# EAGLE design ms5839_without_trub (EAGLE 9.6.2)
COMPONENTS: MS5839; DESCRIPTION: Sensormodul; DRAWING_VERSION: 1.0; DRAWN: Tobias Poppe; FIRMA: Tobias Poppe; PRINTDATE: 30.01.2023; PROJECT: Open-WaLeS; STATUS: Prod.
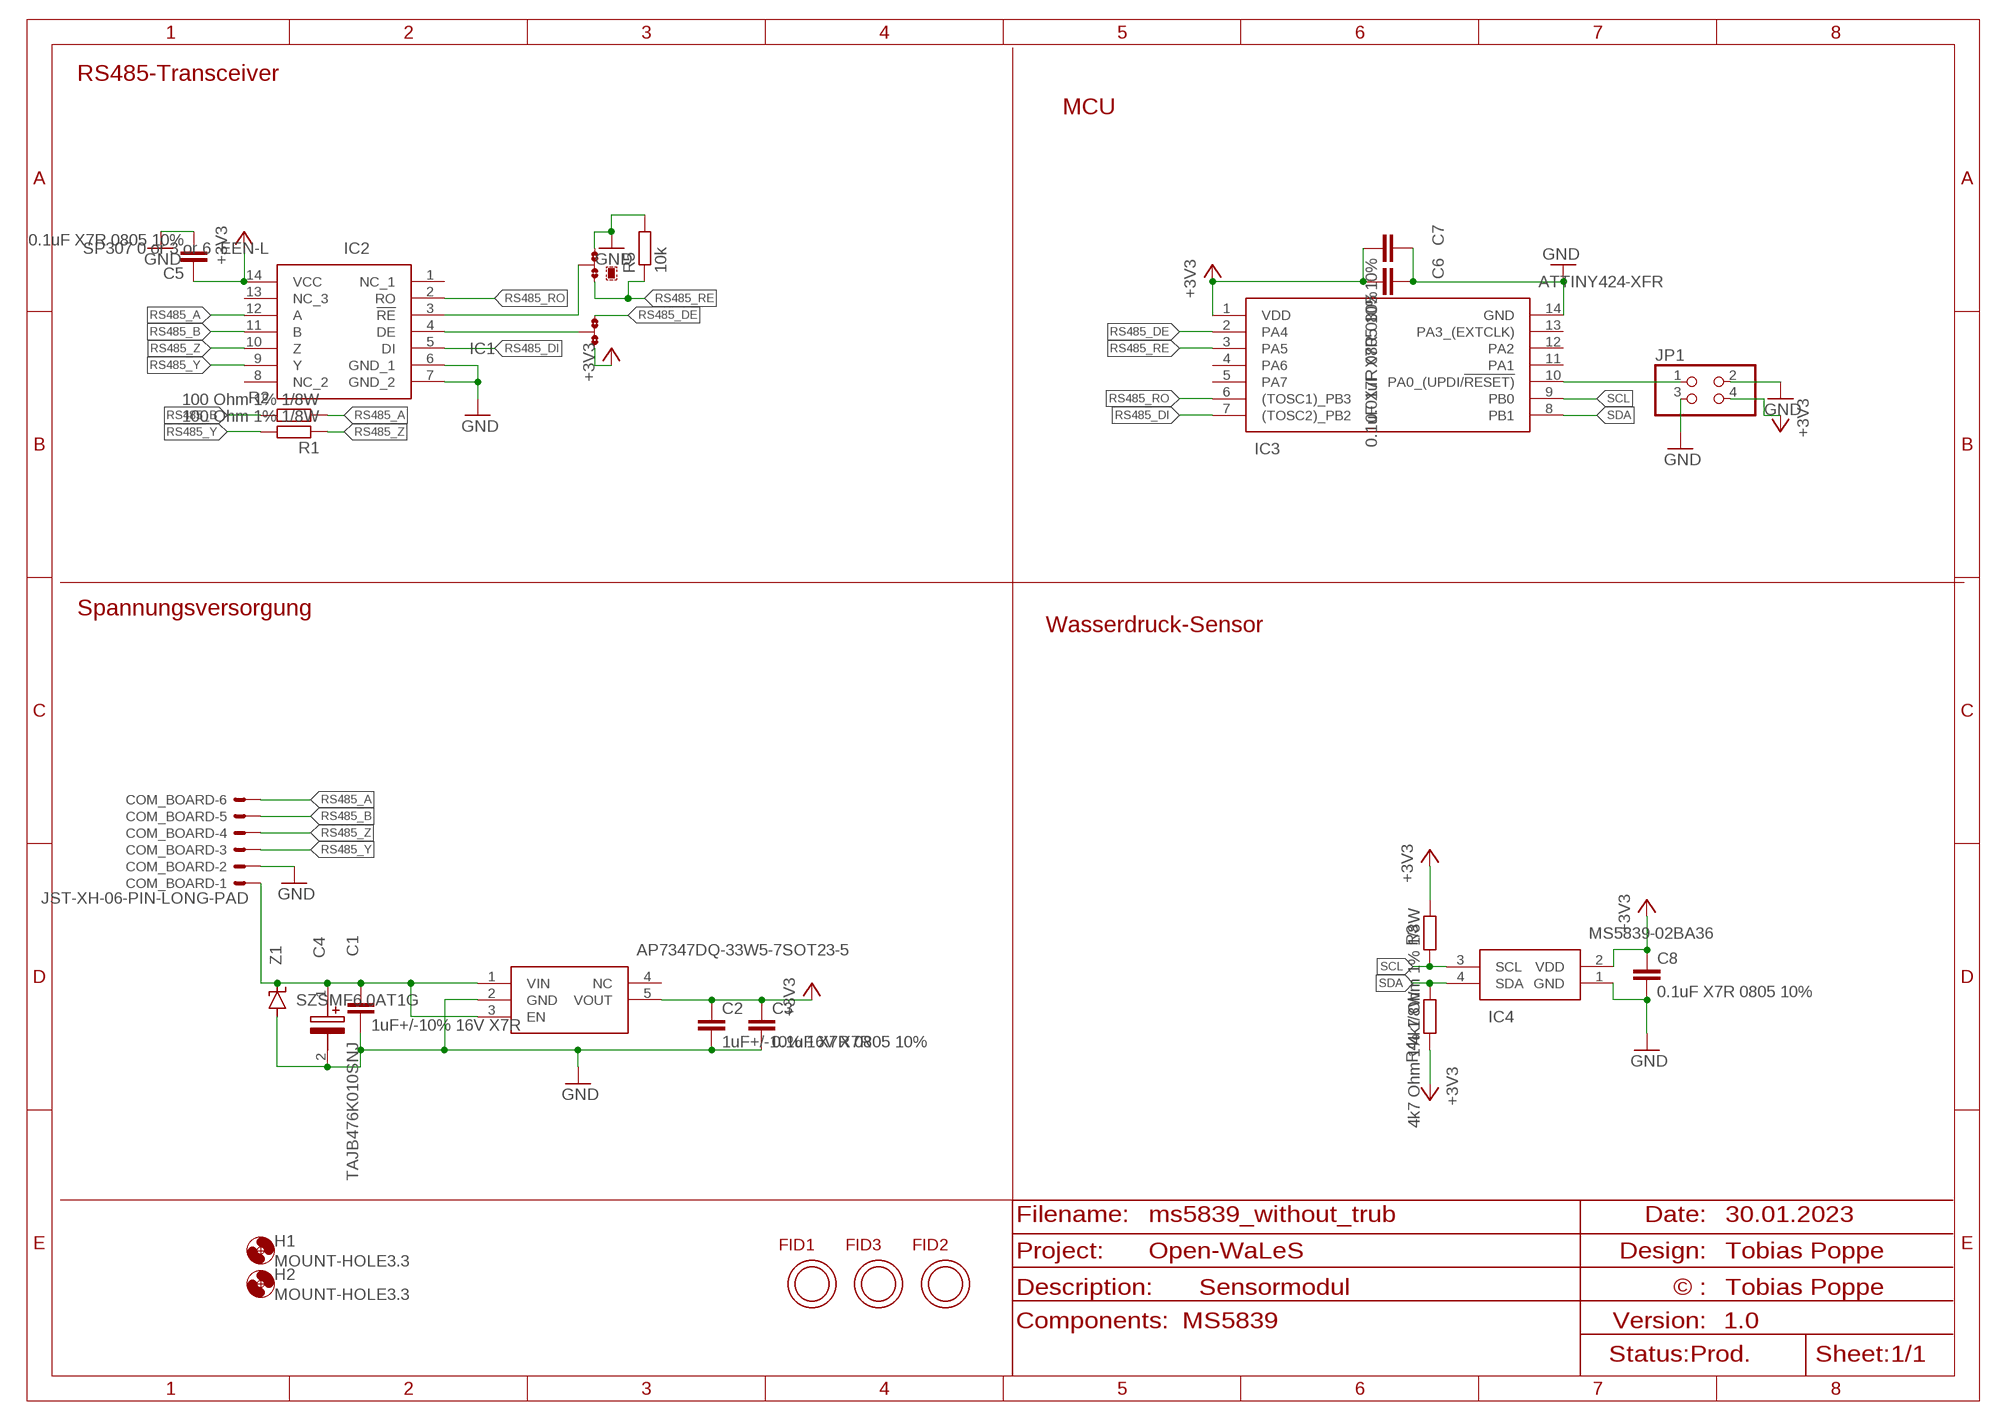
[diagram p0: schematic, sheet 1]

## Parts
C1  1uF+/-10% 16V X7R  C-EUC0805  [C0805]
C2  1uF+/-10% 16V X7R  C-EUC0805  [C0805]
C3  0.1uF X7R 0805 10%  C-EUC0805  [C0805]
C4  TAJB476K010SNJ  [CAPPM3528X210N]
C5  0.1uF X7R 0805 10%  C-EUC0805  [C0805]
C6  0.1uF X7R 0805 10%  C-EUC0805  [C0805]
C7  0.01uF X7R 0805 10%  C-EUC0805  [C0805]
C8  0.1uF X7R 0805 10%  C-EUC0805  [C0805]
COM_BOARD  JST-XH-06-PIN-LONG-PAD  [JST-XH-06-PACKAGE-LONG-PAD]
FID1  OPEN-PNP-FIDUCIAL  [OPEN-PNP-FIDUCIAL]
FID2  OPEN-PNP-FIDUCIAL  [OPEN-PNP-FIDUCIAL]
FID3  OPEN-PNP-FIDUCIAL  [OPEN-PNP-FIDUCIAL]
H1  MOUNT-HOLE3.3  [3,3]
H2  MOUNT-HOLE3.3  [3,3]
IC1  AP7347DQ-33W5-7SOT23-5  [SOT95P240X110-5N]
IC2  SP307 0 or 3 or 6 EEN-L  SP3076EEN-L  [SOIC127P600X175-14N]
IC3  ATTINY424-XFR  [SOP65P640X120-14N]
IC4  MS5839-02BA36  [MS583902BA36]
JMP1  0R-JUMPA  [A0R-JMP]
JMP2  0R-JUMPA  [A0R-JMP]
JP1  PINHD-2X2  [2X02]
R1  100 Ohm 1% 1/8W  R-EU_R0805  [R0805]
R2  100 Ohm 1% 1/8W  R-EU_R0805  [R0805]
R3  4k7 Ohm 1% 1/8W  R-EU_R0805  [R0805]
R4  4k7 Ohm 1% 1/8W  R-EU_R0805  [R0805]
R5  10k  R-EU_M0805  [M0805]
Z1  SZSMF6.0AT1G  SZSMF_XX  [SOD123]

## Nets
!RE: IC2.3(!RE) JMP2.2
+3V3: C2.1 C3.1 C5.1 C6.2 C7.2 C8.1 IC1.5(VOUT) IC2.14(VCC) IC3.1(VDD) IC4.2(VDD) JMP1.1 JP1.4 R3.1 R4.2
DE: IC2.4(DE) JMP1.2
GND: C1.2 C2.2 C3.2 C4.2(-) C5.2 C6.1 C7.1 C8.2 COM_BOARD.2 IC1.2(GND) IC2.6(GND_1) IC2.7(GND_2) IC3.14(GND) IC4.1(GND) JMP2.3 JP1.2 JP1.3 R5.2 Z1.A
N$1: C1.1 C4.1(+) COM_BOARD.1 IC1.1(VIN) IC1.3(EN) Z1.C
N$2: IC3.10(PA0_(UPDI/!RESET)) JP1.1
RS485_A: COM_BOARD.6 IC2.12(A) R2.1
RS485_B: COM_BOARD.5 IC2.11(B) R2.2
RS485_DE: IC3.2(PA4) JMP1.3
RS485_DI: IC2.5(DI) IC3.7((TOSC2)_PB2)
RS485_RE: IC3.3(PA5) JMP2.1 R5.1
RS485_RO: IC2.2(RO) IC3.6((TOSC1)_PB3)
RS485_Y: COM_BOARD.3 IC2.9(Y) R1.2
RS485_Z: COM_BOARD.4 IC2.10(Z) R1.1
SCL: IC3.9(PB0) IC4.3(SCL) R3.2
SDA: IC3.8(PB1) IC4.4(SDA) R4.1
Unconnected: IC1.4(NC) IC2.1(NC_1) IC2.8(NC_2) IC2.13(NC_3) IC3.4(PA6) IC3.5(PA7) IC3.11(PA1) IC3.12(PA2) IC3.13(PA3_(EXTCLK))

## Notes on the sheet
- RS485-Transceiver
- MCU
- Spannungsversorgung
- Wasserdruck-Sensor

## Library data of the parts
C1-C3 C5-C8 = rcl:C-EU: CAPACITOR, European symbol; SPICEPREFIX: C
C4 = samacsys:TAJB476K010SNJ: Tantalum Capacitors - Solid SMD 10volts 47uF 10% Source: Datasheet <http://datasheets.avx.com/TAJ.pdf>; ARROW_PART_NUMBER: TAJB476K010SNJ; ARROW_PRICE-STOCK: https://www.arrow.com/en/products/tajb476k010snj/avx; DESCRIPTION: Tantalum Capacitors - Solid SMD 10volts 47uF 10%; HEIGHT: 2.1mm; MANUFACTURER_NAME: AVX; MANUFACTURER_PART_NUMBER: TAJB476K010SNJ; MOUSER_PART_NUMBER: 581-TAJB476K010SNJ; MOUSER_PRICE-STOCK: https://www.mouser.co.uk/ProductDetail/AVX/TAJB476K010SNJ?qs=ZkOCJBwOl244F5j46leeNA%3D%3D
COM_BOARD = Rembrandt Electronics - JST XH Connectors v1-0:JST-XH-06-PIN: JST XH Connector 2 Pin Wire to board connector. Pitch: 2,54 mm, (0.100") Number of pins: 6 Created by Rembrandt Electronics www.rembrandtelectronics.com
FID1-FID3 = topo-eng:OPEN-PNP-FIDUCIAL
H1 H2 = holes:MOUNT-HOLE: MOUNTING HOLE with drill center marker
IC1 = samacsys:AP7347DQ-33W5-7: LDO Voltage Regulators LDO CMOS LowCurr SOT25 T&R 3K Source: Datasheet <https://ad.componentsearchengine.com/partRequest.html?fs=0&partNumber=AP7347DQ-33W5-7&partID=15420390&lang=null&packageCategoryID=54&C=1&W=1>
IC2 = samacsys:SP3076EEN-L: RS-422/RS-485 Interface IC RS485/RS422 Driver/ Receiver Transceiver Source: Datasheet <https://www.exar.com/content/document.ashx?id=1399>; DESCRIPTION: RS-422/RS-485 Interface IC RS485/RS422 Driver/ Receiver Transceiver; HEIGHT: 1.75mm; MANUFACTURER_NAME: MaxLinear, Inc.; MANUFACTURER_PART_NUMBER: SP3076EEN-L; MOUSER_PART_NUMBER: 701-SP3076EEN-L; MOUSER_PRICE-STOCK: https://www.mouser.co.uk/ProductDetail/MaxLinear/SP3076EEN-L?qs=H%252BP%2FcHWii3dfBcWqKh1L5g%3D%3D
IC3 = samacsys:ATTINY424-XFR: 8-bit Microcontrollers - MCU 20MHz, 4KB, TSSOP14, Ind 125C, Green, T&R Source: Datasheet <https://eu.mouser.com/datasheet/2/268/ATtiny1624_26_27_DataSheet_DS40002234A-1984012.pdf>; DESCRIPTION: 8-bit Microcontrollers - MCU 20MHz, 4KB, TSSOP14, Ind 125C, Green, T&R; HEIGHT: 1.2mm; MANUFACTURER_NAME: Microchip; MANUFACTURER_PART_NUMBER: ATTINY424-XFR; MOUSER_PART_NUMBER: 579-ATTINY424-XFR; MOUSER_PRICE-STOCK: https://www.mouser.co.uk/ProductDetail/Microchip-Technology/ATTINY424-XFR?qs=pUKx8fyJudDOEG3jn4DZaw%3D%3D
IC4 = samacsys:MS5839-02BA36: Board Mount Pressure Sensors MS5839-02BA36 CL RESISTANT LS T&R SEN Source: Datasheet <https://www.te.com/commerce/DocumentDelivery/DDEController?Action=srchrtrv&DocNm=MS5839-02BA&DocType=DS&DocLang=English>; DESCRIPTION: Board Mount Pressure Sensors MS5839-02BA36 CL RESISTANT LS T&R SEN; HEIGHT: 2.65mm; MANUFACTURER_NAME: TE Connectivity; MANUFACTURER_PART_NUMBER: MS5839-02BA36; MOUSER_PART_NUMBER: 824-MS5839-02BA36; MOUSER_PRICE-STOCK: https://www.mouser.co.uk/ProductDetail/Measurement-Specialties/MS5839-02BA36?qs=xZ%2FP%252Ba9zWqZ%2FNhMNRu8tng%3D%3D
JMP1 JMP2 = jump-0r-smd:0R-JUMP: SMD 0R 0805 Jumper
JP1 = pinhead:PINHD-2X2: PIN HEADER
R1-R5 = rcl:R-EU_: RESISTOR, European symbol; SPICEPREFIX: R
Z1 = topo-eng:SZSMF_XX

## Board
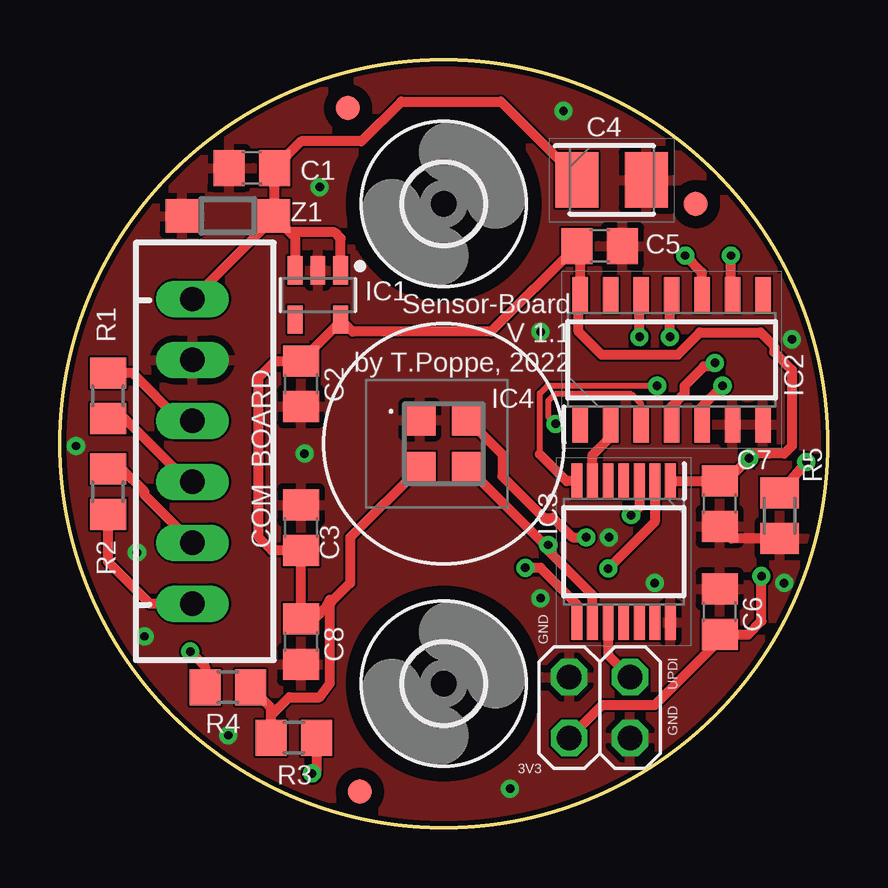
[diagram p1: board, top side]
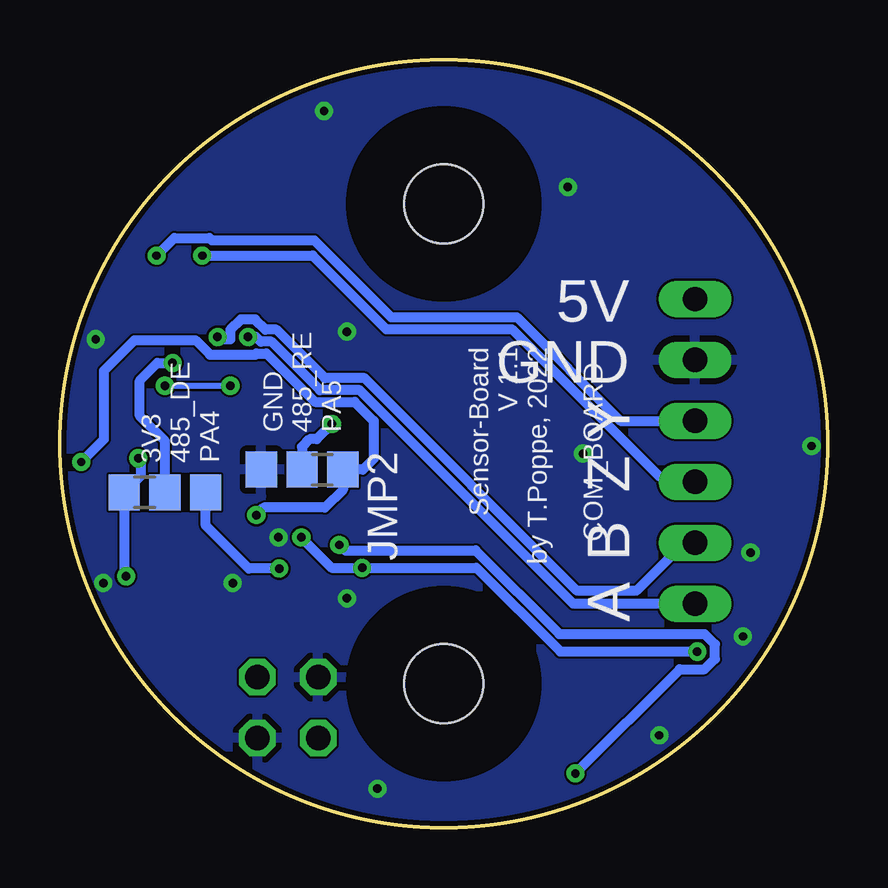
[diagram p2: board, bottom side, seen from below]

Size 32 x 32 mm. Coordinates in mm from the lower left corner, seen from the top.
Outline: circle at 16,16 radius 16
Copper layers (1*16): Top 0.035mm / dielectric 1.065mm / Bottom 0.035mm
Design rules "jlcpcb_4_layer *": minimum track width 3.5mil, minimum drill 0.2mm, track to track 3.5mil, track to pad 6mil, pad to pad 6mil, via to via 6mil, smd to smd 6mil, copper to edge 0.2mm, drill to drill 6mil, minimum pad ring 10mil, minimum via ring 8mil, stop-mask expansion 4mil, vias tented up to drill 0mil, thermal gap 10mil

### Footprints (pad centres in the part's own frame; a part is rotated, then mirrored left to right if it is on the bottom)
C0805 = smd 1.3 x 1.5: 1 -0.95,0; 2 0.95,0
CAPPM3528X210N = smd 1.8 x 2.3: 1 -1.45,0; 2 1.45,0
JST-XH-06-PACKAGE-LONG-PAD = drill 1.016 long: 1 -6.35,0; 2 -3.81,0; 3 -1.27,0; 4 1.27,0; 5 3.81,0; 6 6.35,0
OPEN-PNP-FIDUCIAL = smd 1 x 1: FID$1 0,0
3,3 = hole 3.3: 0,0
SOT95P240X110-5N = smd 1.18 x 0.609: 1 -1.024,0.95; 2 -1.024,0; 3 -1.024,-0.95; 4 1.024,-0.95; 5 1.024,0.95
SOIC127P600X175-14N = smd 1.5 x 0.65: 1 -2.7,3.81; 2 -2.7,2.54; 3 -2.7,1.27; 4 -2.7,0; 5 -2.7,-1.27; 6 -2.7,-2.54; 7 -2.7,-3.81; 8 2.7,-3.81; 9 2.7,-2.54; 10 2.7,-1.27; 11 2.7,0; 12 2.7,1.27; 13 2.7,2.54; 14 2.7,3.81
SOP65P640X120-14N = smd 1.475 x 0.45: 1 -2.938,1.95; 2 -2.938,1.3; 3 -2.938,0.65; 4 -2.938,0; 5 -2.938,-0.65; 6 -2.938,-1.3; 7 -2.938,-1.95; 8 2.938,-1.95; 9 2.938,-1.3; 10 2.938,-0.65; 11 2.938,0; 12 2.938,0.65; 13 2.938,1.3; 14 2.938,1.95
MS583902BA36 = smd 1.3 x 1.3: 1 1,-1; 2 1,1; 3 -1,1; 4 -1,-1
A0R-JMP = smd 1.5 x 1.3: 1 0,1.7; 2 0,0; 3 0,-1.7
2X02 = drill 1.016 octagon: 1 -1.27,-1.27; 2 -1.27,1.27; 3 1.27,-1.27; 4 1.27,1.27
R0805 = smd 1.3 x 1.5: 1 -0.95,0; 2 0.95,0
M0805 = smd 1.3 x 1.6: 1 -0.95,0; 2 0.95,0
SOD123 = smd 1.4 x 1.4: A 1.9,0; C -1.9,0

### Placement (x,y rotation side)
C1  8,27.5 180 top
C2  10.05,18.5 270 top
C3  10.05,12.5 90 top
C4  23,27 0 top
C5  22.5,24.25 0 top
C6  27.5,9 270 top
C7  27.5,13.5 90 top
C8  10.05,7.75 270 top
COM_BOARD  5.52,15.68 270 top
FID1  12.5,1.5 0 top
FID2  26.5,26 0 top
FID3  12,30 0 top
H1  16,26 0 top
H2  16,6 0 top
IC1  10.75,22.2 270 top
IC2  25.5,19.5 90 top
IC3  23.5,11.5 270 top
IC4  16,16 180 top
JMP1  27.62,13.97 90 bottom
JMP2  21.91,14.92 270 bottom
JP1  22.5,5 180 top
R1  2,18 90 top
R2  2,14 90 top
R3  9.75,3.75 0 top
R4  7,5.85 0 top
R5  30,13 270 top
Z1  7,25.5 180 top

### Tracks (layer width: path | path; a pad name or v marks a point on that pad's centre or on a via)
!RE  (via drill 0.35)
  Top 0.254: IC2.3 24.23,17.66 23.81,18.07 20.64,18.07 20.34,17.78 20.34,17.14 v20.66,16.83
  Bottom 0.406: v20.66,16.83 21.3,16.19 21.59,16.19 21.91,15.88 JMP2.2
+3V3  (via drill 0.35)
  Top 0.406: IC4.2 12.1,12.1 12.1,10.19 11.3,9.4 11.1,9.19 | 11.1,9.19 11.25,9.51 11.25,6.02 10.83,5.43 9.56,5.43 8.8,4.67 R3.1 8.8,5 R4.2 | 11.1,9.19 10.61,8.7 C8.1 C3.1 8.84,11.55 8.29,12.1 8.29,18.77 8.97,19.45 C2.1 11.7,21.1 IC1.5 12.21,20.67 17.97,20.67 C5.1 21.69,24.11 IC2.14 21.62,22.13 21.62,20.67 22.57,19.72 25.75,19.72 26.67,20.64 29.21,20.64 29.78,20.07 29.78,19.82 30.51,19.08 30.51,15.91 30.2,15.59 29.56,15.59 28.93,15.59 v28.73,15.4 27.79,14.45 C7.2 27.49,14.44 IC3.1 | JP1.4 22.61,5.11 24.8,5.11 27.5,7.82 C6.2 28.69,8.05 29.24,8.61 v29.24,10.48
  Bottom 0.406: v29.24,10.48 29.32,10.56 JMP1.1 28.63,14.66 28.63,15.29 v28.73,15.4
DE  (via drill 0.35)
  Top 0.406: v27.3,19.37 27.16,19.22 26.84,19.22 26.04,18.41 26.04,18.1 25.5,17.56 IC2.4
  Bottom 0.406: v27.3,19.37 27.94,19.37 28.67,18.63 28.67,17.16 27.62,16.11 JMP1.2
GND  (via drill 0.35)
  Top 0.406: R5.2 28,12.05 C7.1
  other vias: 10.19,15.59 24.8,10.19 30.2,10.19 7.02,3.84 30.51,20.35 10.83,26.7 0.67,15.91 20.04,20.67 20.99,29.88 3.52,7.97 3.21,11.46 18.77,1.62 20.04,9.56 22.89,12.1
  pour Top: 32,0 32,32 0,32 0,0
  pour Bottom: 32,32 32,0 0,0 0,32
N$1
  Top 0.406: COM_BOARD.1 8.9,25.41 Z1.C | Z1.C 8.95,25.55 C1.1 10.06,28.61 12.57,28.61 14.23,30.27 18.38,30.27 21.55,27.09 C4.1 | Z1.C 9.58,24.82 | 9.58,24.82 9.8,24.6 IC1.3 | IC1.1 11.7,24.56 11.44,24.82 9.58,24.82
N$2
  Top 0.406: IC3.10 22.85,7.19 JP1.1
RS485_A  (via drill 0.35)
  Top 0.406: COM_BOARD.6 3.75,9.33 2,11.08 R2.1 | v24.16,20.45 24.16,22.13 IC2.12
  Bottom 0.406: COM_BOARD.6 10.6,9.33 19.51,18.24 21.16,18.24 23.18,20.26 23.63,20.26 23.82,20.45 v24.16,20.45
RS485_B  (via drill 0.35)
  Top 0.406: COM_BOARD.5 3.52,13.87 3.52,14 2.58,14.95 R2.2 | v25.43,20.45 25.43,22.13 IC2.11
  Bottom 0.406: COM_BOARD.5 5.97,11.87 7.97,9.88 10.45,9.88 19.3,18.73 20.95,18.73 22.98,20.75 23.43,20.75 23.86,21.18 24.47,21.18 24.9,20.75 24.9,20.35 25.33,20.35 v25.43,20.45
RS485_DE  (via drill 0.35)
  Top 0.406: IC3.2 24.8,12.73 v22.86,10.79
  Bottom 0.406: v22.86,10.79 24.13,10.79 25.92,12.59 JMP1.3
RS485_DI  (via drill 0.35)
  Top 0.254: 20,15.56 20,18.1 20.32,18.41 v24.9,18.41
  Top 0.406: IC3.7 21.12,14.44 20,15.56 | IC2.5 26.77,17.56 v27.62,18.41
  Bottom 0.254: v24.9,18.41 v27.62,18.41
RS485_RE  (via drill 0.35)
  Top 0.406: v31.11,15.24 R5.1 | IC3.3 24.15,13.37 v23.81,13.03
  Bottom 0.406: v23.81,13.03 23.51,13.34 20.95,13.34 20.21,14.08 JMP2.1 19.37,14.92 18.92,15.37 18.92,16.95 19.71,17.74 21.36,17.74 23.39,19.77 23.81,19.77 23.86,19.72 25.75,19.72 26.35,20.32 28.89,20.32 30.16,19.05 30.16,16.19 v31.11,15.24
RS485_RO
  Top 0.406: IC3.6 22.2,15.53 22.96,16.29 IC2.2
RS485_Y  (via drill 0.35)
  Top 0.406: COM_BOARD.3 5.02,16.95 3.02,18.95 R1.2 | IC2.9 27.97,22.27 v27.97,23.84
  Bottom 0.406: v27.97,23.84 27.24,24.58 25.76,24.58 25.66,24.48 21.4,24.48 18.2,21.28 12.96,21.28 8.63,16.95 COM_BOARD.3
RS485_Z  (via drill 0.35)
  Top 0.406: COM_BOARD.4 5.34,14.41 2.7,17.05 R1.1 | IC2.10 26.77,23.14 v26.07,23.84
  Bottom 0.406: v26.07,23.84 21.47,23.84 18.4,20.78 13.16,20.78 7.02,14.64 5.75,14.64 COM_BOARD.4
SCL  (via drill 0.35)
  Top 0.406: R3.2 10.7,2.44 v10.51,2.25 | IC3.9 22.2,9.7 20.35,11.54 v20.35,11.78 20.22,11.78 IC4.3
  Bottom 0.406: v10.51,2.25 6.16,6.6 5.13,6.6 4.7,7.03 4.7,7.64 5.13,8.07 11.18,8.07 14.67,11.56 20.13,11.56 v20.35,11.78
SDA  (via drill 0.35)
  Top 0.406: IC3.8 21.55,9.31 20.04,10.83 v19.4,10.83 | v5.43,7.33 6.05,6.71 R4.1 | IC4.4 18.45,15.55 18.45,14.64 20.18,12.91 20.56,12.91 21.37,12.1 v21.94,12.1
  Bottom 0.406: v5.43,7.33 11.14,7.33 14.64,10.83 v19.4,10.83 20.67,10.83 v21.94,12.1

### Text on the board
bPlace: 5V | GND | Y | Z | B | A
tNames: Sensor-Board / V 1.1 / by T.Poppe, 2022 | GND | UPDI | GND | 3V3
bNames: Sensor-Board / V 1.1 / by T.Poppe, 2022 | COM_BOARD | GND / 485_RE / PA5 | 3V3 / 485_DE / PA4